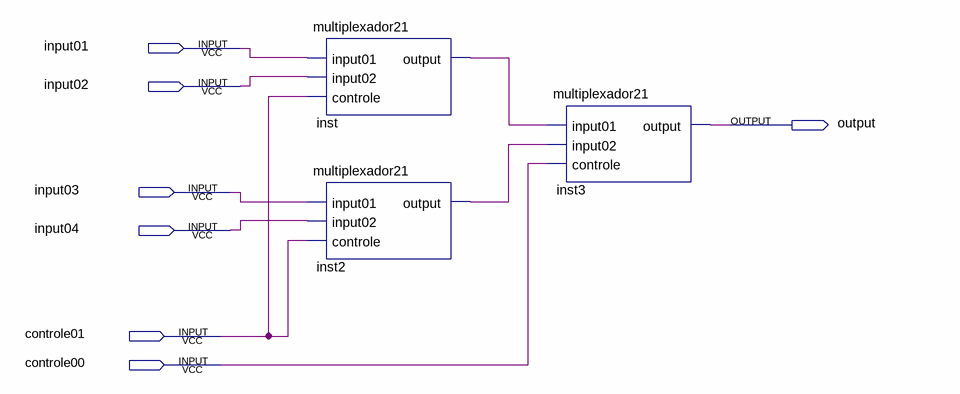
[diagram p0: schematic sheet]
// Quartus schematic multiplexador41.bdf as structural Verilog: 3 symbols, 7 pins
module multiplexador41 (
  input  input01,
  input  input02,
  input  input03,
  input  input04,
  input  controle01,
  input  controle00,
  output \output 
);

  wire inst2_output, inst_output;

  multiplexador21 inst (.input01(input01), .input02(input02), .controle(controle01), .\output (inst_output));
  multiplexador21 inst2 (.input01(input03), .input02(input04), .controle(controle01), .\output (inst2_output));
  multiplexador21 inst3 (.input01(inst_output), .input02(inst2_output), .controle(controle00), .\output (\output ));
endmodule
